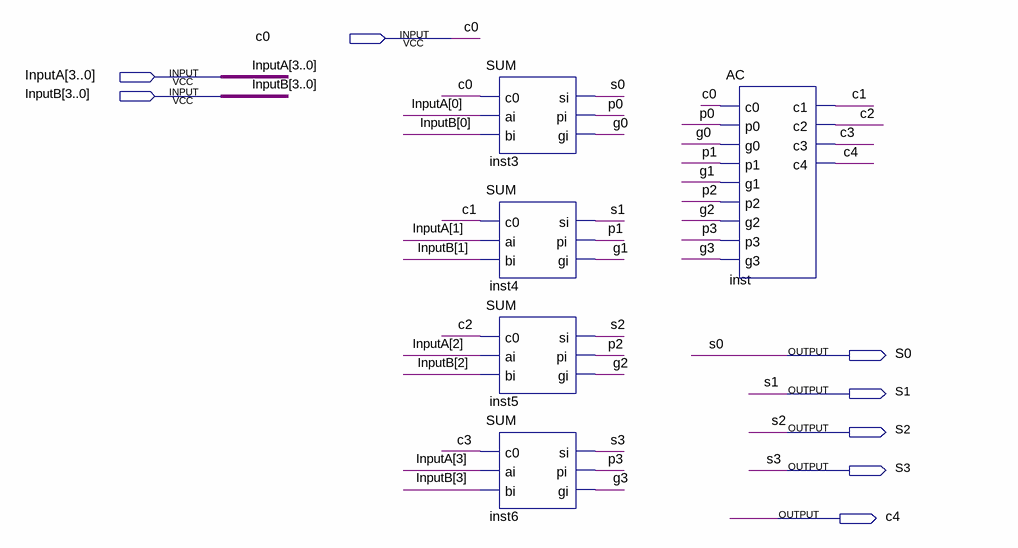
[diagram p0: schematic sheet]
// Quartus schematic sum4bit.bdf as structural Verilog: 5 symbols, 8 pins
module sum4bit (
  input  c0,
  input  [3:0] InputA,
  input  [3:0] InputB,
  output S0,
  output S1,
  output S2,
  output S3,
  output c4
);

  wire c1, c2, c3, g0, g1, g2, g3, p0, p1, p2, p3;

  SUM inst3 (.c0(c0), .ai(InputA[0]), .bi(InputB[0]), .si(S0), .pi(p0), .gi(g0));
  SUM inst4 (.c0(c1), .ai(InputA[1]), .bi(InputB[1]), .si(S1), .pi(p1), .gi(g1));
  SUM inst5 (.c0(c2), .ai(InputA[2]), .bi(InputB[2]), .si(S2), .pi(p2), .gi(g2));
  SUM inst6 (.c0(c3), .ai(InputA[3]), .bi(InputB[3]), .si(S3), .pi(p3), .gi(g3));
  AC inst (
    .c0(c0), .p0(p0), .g0(g0), .p1(p1), .g1(g1), .p2(p2), .g2(g2), .p3(p3), .g3(g3), .c1(c1), .c2(c2),
    .c3(c3), .c4(c4));
endmodule
